# EAGLE design Carte_Puissance_Mark1 (EAGLE 6.1)
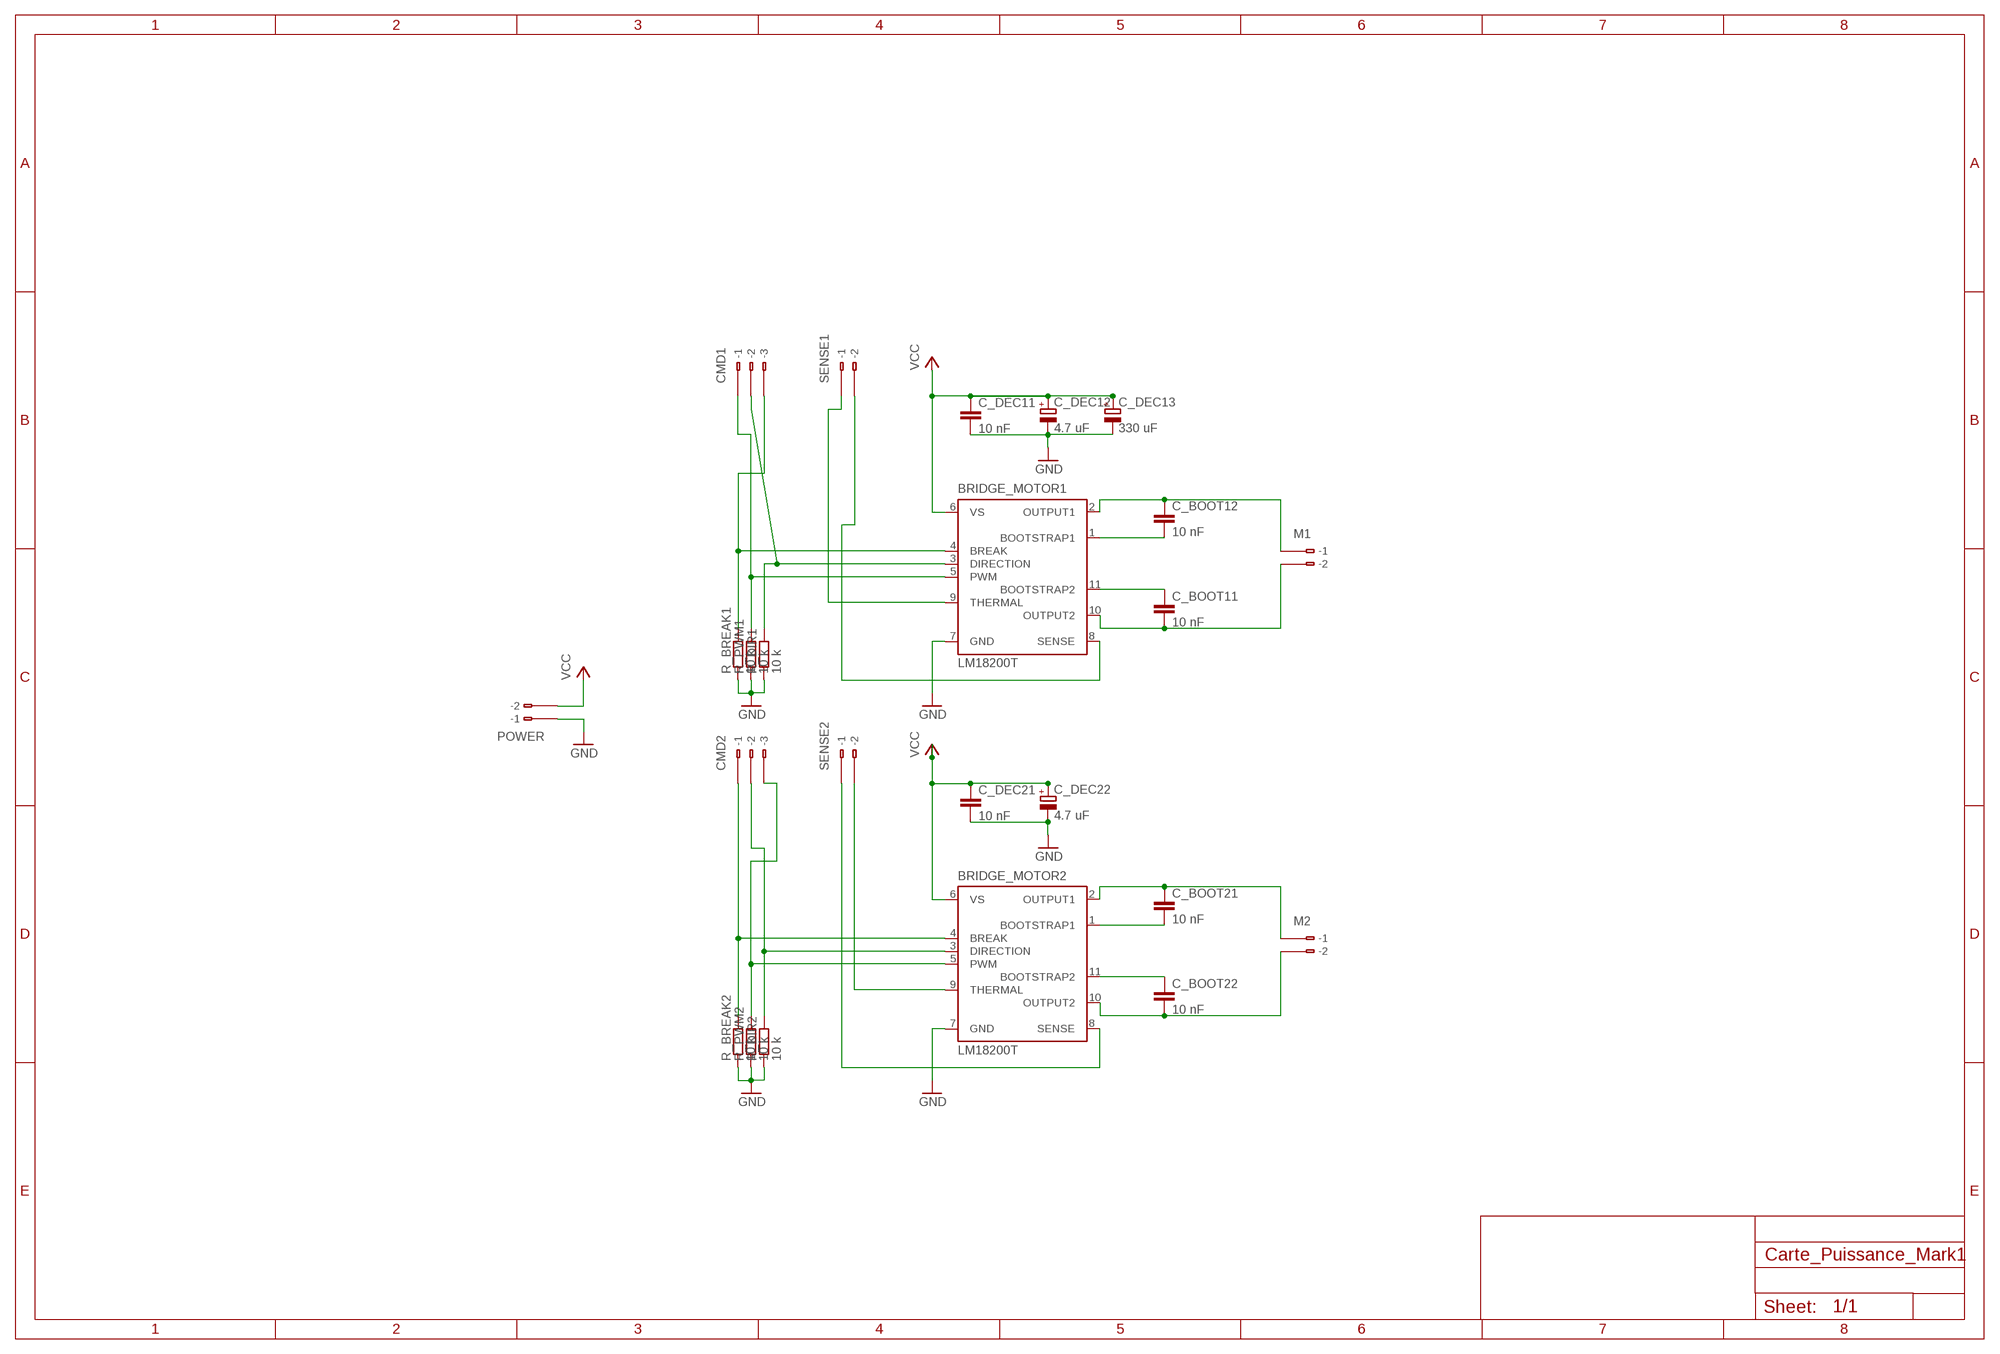
[diagram p0: schematic, sheet 1]

## Parts
BRIDGE_MOTOR1  LM18200T  [TO-220-11]
BRIDGE_MOTOR2  LM18200T  [TO-220-11]
C_BOOT11  10 nF  C5/3  [C5B3]
C_BOOT12  10 nF  C5/3  [C5B3]
C_BOOT21  10 nF  C5/3  [C5B3]
C_BOOT22  10 nF  C5/3  [C5B3]
C_DEC11  10 nF  C5/3  [C5B3]
C_DEC12  4.7 uF  CPOL-EUE2-5  [E2-5]
C_DEC13  330 uF  CPOL-EUE5-10.5  [E5-10,5]
C_DEC21  10 nF  C5/3  [C5B3]
C_DEC22  4.7 uF  CPOL-EUE2-5  [E2-5]
CMD1  233-103  [233-103]
CMD2  233-103  [233-103]
M1  233-102  [233-102]
M2  233-102  [233-102]
POWER  233-102  [233-102]
R_BREAK1  10 k  R-EU_R2012  [R2012]
R_BREAK2  10 k  R-EU_R2012  [R2012]
R_DIR1  10 k  R-EU_R2012  [R2012]
R_DIR2  10 k  R-EU_R2012  [R2012]
R_PWM1  10 k  R-EU_R2012  [R2012]
R_PWM2  10 k  R-EU_R2012  [R2012]
SENSE1  233-102  [233-102]
SENSE2  233-102  [233-102]

## Nets
GND: BRIDGE_MOTOR1.7(GND) BRIDGE_MOTOR2.7(GND) C_DEC11.2 C_DEC12.- C_DEC13.- C_DEC21.2 C_DEC22.- R_BREAK1.1 R_BREAK2.1 R_DIR1.1 R_DIR2.1 R_PWM1.1 R_PWM2.1
N$1: BRIDGE_MOTOR1.4(BREAK) CMD1.B3(B-3) R_BREAK1.2
N$2: BRIDGE_MOTOR1.5(PWM) CMD1.B1(B-1) R_PWM1.2
N$3: BRIDGE_MOTOR2.11(BOOTSTRAP2) C_BOOT22.1
N$4: BRIDGE_MOTOR2.1(BOOTSTRAP1) C_BOOT21.2
N$5: BRIDGE_MOTOR2.2(OUTPUT1) C_BOOT21.1 M2.B1(B-1)
N$6: BRIDGE_MOTOR2.10(OUTPUT2) C_BOOT22.2 M2.B2(B-2)
N$7: BRIDGE_MOTOR1.11(BOOTSTRAP2) C_BOOT11.1
N$8: BRIDGE_MOTOR1.1(BOOTSTRAP1) C_BOOT12.2
N$9: BRIDGE_MOTOR1.2(OUTPUT1) C_BOOT12.1 M1.B1(B-1)
N$10: BRIDGE_MOTOR1.10(OUTPUT2) C_BOOT11.2 M1.B2(B-2)
N$11: BRIDGE_MOTOR1.3(DIRECTION) CMD1.B2(B-2) R_DIR1.2
N$12: BRIDGE_MOTOR1.9(THERMAL) SENSE1.B1(B-1)
N$13: BRIDGE_MOTOR1.8(SENSE) SENSE1.B2(B-2)
N$14: BRIDGE_MOTOR2.4(BREAK) CMD2.B1(B-1) R_BREAK2.2
N$15: BRIDGE_MOTOR2.5(PWM) CMD2.B3(B-3) R_PWM2.2
N$16: BRIDGE_MOTOR2.3(DIRECTION) CMD2.B2(B-2) R_DIR2.2
N$17: BRIDGE_MOTOR2.9(THERMAL) SENSE2.B2(B-2)
N$18: BRIDGE_MOTOR2.8(SENSE) SENSE2.B1(B-1)
POWERT: POWER.B1(B-1) ; supply symbol labelled GND
VCC: BRIDGE_MOTOR1.6(VS) BRIDGE_MOTOR2.6(VS) C_DEC11.1 C_DEC12.+ C_DEC13.+ C_DEC21.1 C_DEC22.+ POWER.B2(B-2)
Unconnected: CMD1.A1(-1) CMD1.A2(-2) CMD1.A3(-3) CMD2.A1(-1) CMD2.A2(-2) CMD2.A3(-3) M1.A1(-1) M1.A2(-2) M2.A1(-1) M2.A2(-2) POWER.A1(-1) POWER.A2(-2) SENSE1.A1(-1) SENSE1.A2(-2) SENSE2.A1(-1) SENSE2.A2(-2)

## Library data of the parts
BRIDGE_MOTOR1 BRIDGE_MOTOR2 = national-semiconductor:LM18200T: 3A, 55V H-Bridge Motor Control SourcE: http://cache.national.com/ds/LM/LMD18200.pdf; OC_FARNELL: unknown; OC_NEWARK: unknown
C_BOOT11 C_BOOT12 C_BOOT21 C_BOOT22 C_DEC11 C_DEC21 = capacitor-wima:C: CAPACITOR naming: grid - package width
C_DEC12 C_DEC13 C_DEC22 = rcl:CPOL-EU: POLARIZED CAPACITOR, European symbol
CMD1 CMD2 = con-wago:233-103: WAGO Cage Clamp; MPN: 233-103; OC_FARNELL: unknown; OC_NEWARK: 28K9045
M1 M2 POWER SENSE1 SENSE2 = con-wago:233-102: WAGO Cage Clamp; MPN: 233-102; OC_FARNELL: unknown; OC_NEWARK: 28K9044
R_BREAK1 R_BREAK2 R_DIR1 R_DIR2 R_PWM1 R_PWM2 = resistor:R-EU_: RESISTOR, European symbol

## Board
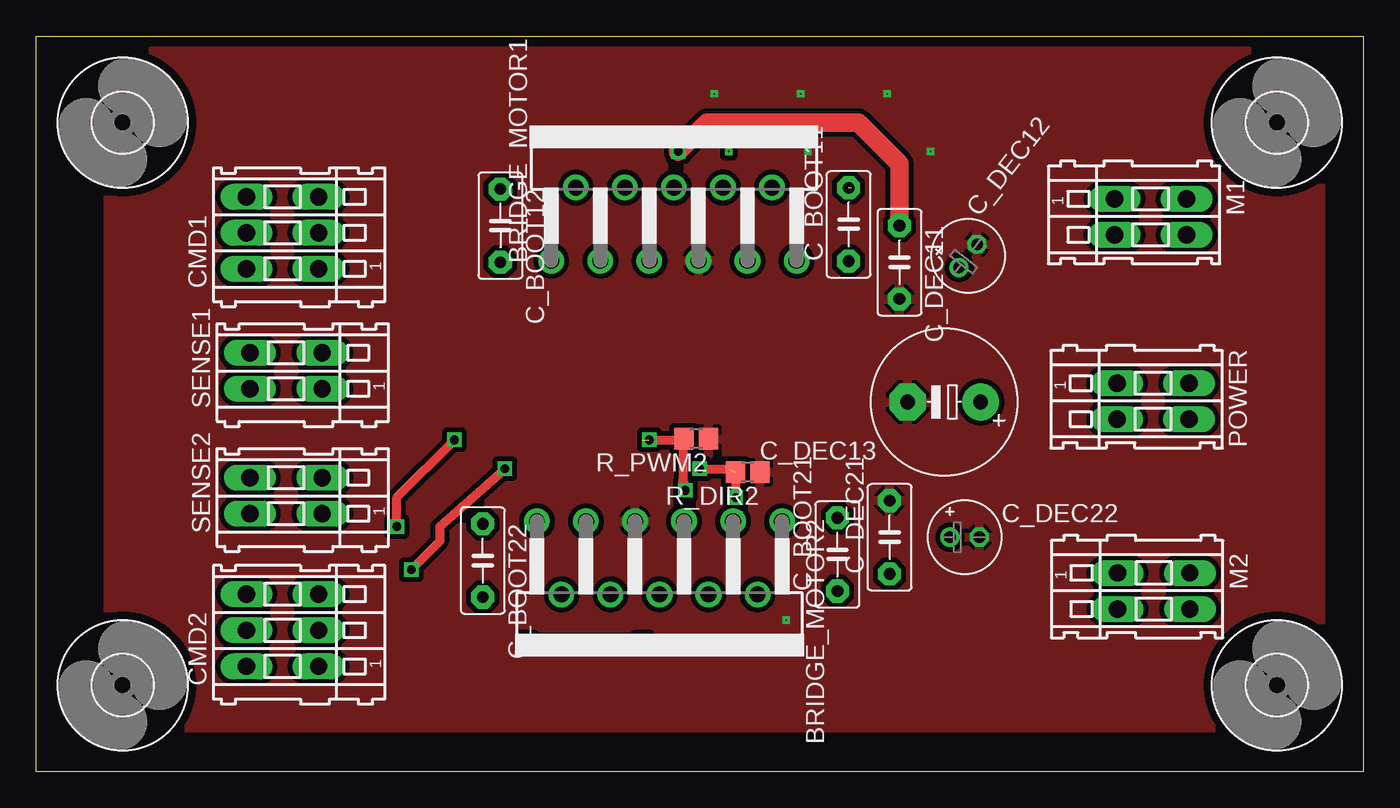
[diagram p1: board, top side]
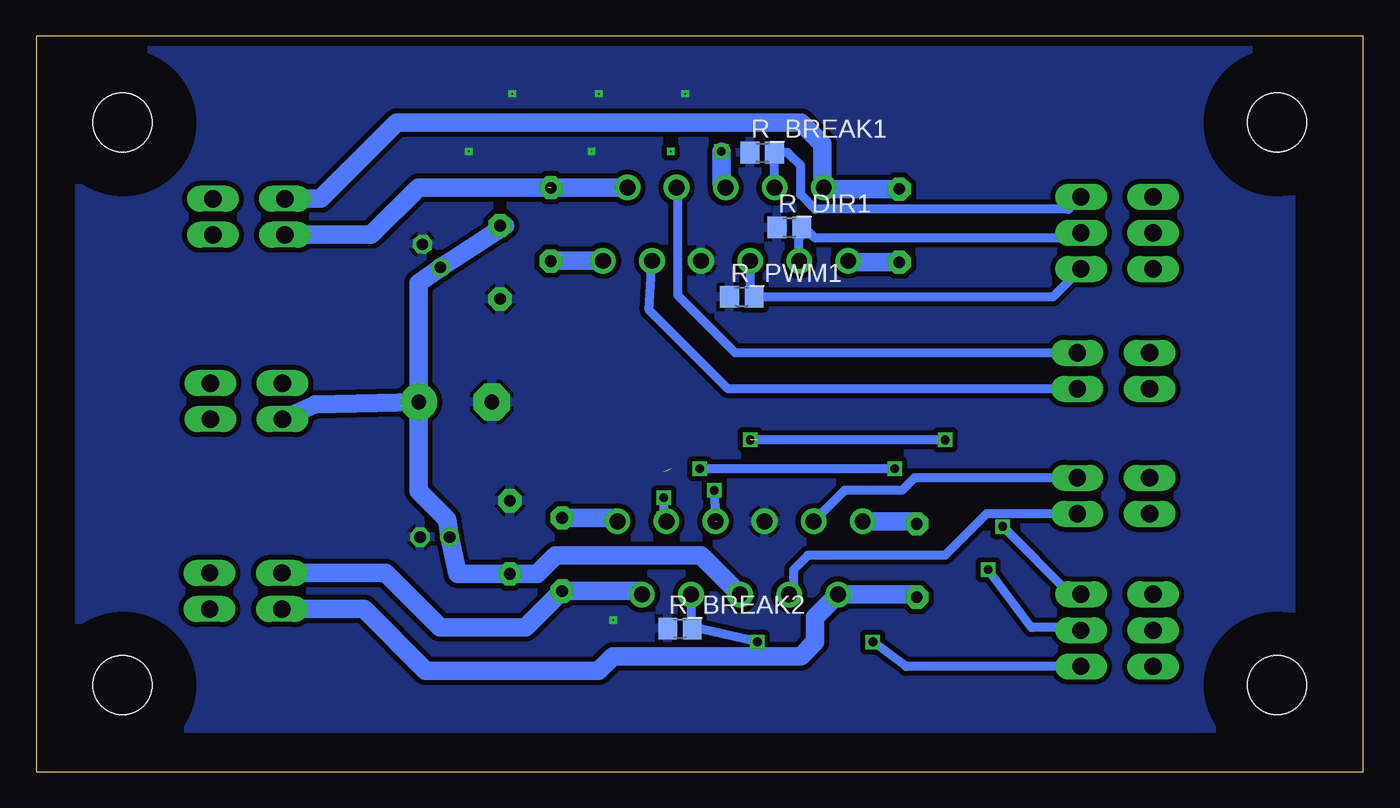
[diagram p2: board, bottom side, seen from below]

Size 92 x 51 mm. Coordinates in mm from the lower left corner, seen from the top.
Outline: 0,0 0,51 92,51 92,0 0,0
Copper layers (1*16): Top 0.035mm / dielectric 1.5mm / Bottom 0.035mm
Design rules: minimum track width 10mil, minimum drill 1mil, track to track 14mil, track to pad 8mil, pad to pad 8mil, via to via 8mil, smd to smd 8mil, copper to edge 0mil, drill to drill 8mil, minimum pad ring 10mil, minimum via ring 8mil, stop-mask expansion 4mil, vias tented up to drill 0mil, thermal gap 10mil

### Footprints (pad centres in the part's own frame; a part is rotated, then mirrored left to right if it is on the bottom)
TO-220-11 = drill 1.1 pad 1.778: 1 -8.5,-9.37; 2 -6.8,-4.29; 3 -5.1,-9.37; 4 -3.4,-4.29; 5 -1.7,-9.37; 6 0,-4.29; 7 1.7,-9.37; 8 3.4,-4.29; 9 5.1,-9.37; 10 6.8,-4.29; 11 8.5,-9.37
C5B3 = drill 0.813 pad 1.6 octagon: 1 -2.54,0; 2 2.54,0
E2-5 = drill 0.813 pad 1.27: + -1.016,0 | drill 0.813 pad 1.27 octagon: - 1.016,0
E5-10,5 = drill 1.016 pad 2.54: + -2.54,0 | drill 1.016 pad 2.54 octagon: - 2.54,0
233-103 = drill 1.2 long: A1 -2.5,2.5; A2 0,2.5; A3 2.5,2.5; B1 -2.5,-2.5; B2 0,-2.5; B3 2.5,-2.5
233-102 = drill 1.2 long: A1 -1.25,2.5; A2 1.25,2.5; B1 -1.25,-2.5; B2 1.25,-2.5
R2012 = smd 1.3 x 1.5: 1 -0.85,0; 2 0.85,0
4,1 = hole 4.1: 0,0

### Placement (x,y rotation side)
BRIDGE_MOTOR1  44.21,44.79 0 top
BRIDGE_MOTOR2  43.21,7.99 180 top
C_BOOT11  56.32,37.94 90 top
C_BOOT12  32.18,37.86 270 top
C_BOOT21  55.54,15.06 90 top
C_BOOT22  30.96,14.64 270 top
C_DEC11  59.84,35.32 270 top
C_DEC12  64.6,35.76 52.1 top
C_DEC13  62.94,25.63 180 top
C_DEC21  59.16,16.25 90 top
C_DEC22  64.36,16.26 0 top
CMD1  17.08,37.36 90 top
CMD2  17.08,9.8 90 top
M1  77.25,38.47 270 top
M2  77.47,12.53 270 top
POWER  77.42,25.69 270 top
R_BREAK1  41.67,42.92 0 bottom
R_BREAK2  47.37,9.92 0 bottom
R_DIR1  39.79,37.73 0 bottom
R_DIR2  49.32,20.77 180 top
R_PWM1  43.08,32.92 0 bottom
R_PWM2  45.76,23.08 180 top
SENSE1  17.33,27.79 90 top
SENSE2  17.33,19.13 90 top
U$1  [4,1]  6,45 0 top
U$2  [4,1]  86,45 0 top
U$3  [4,1]  86,6 0 top
U$4  [4,1]  6,6 0 top

### Tracks (layer width: path | path; a pad name or v marks a point on that pad's centre or on a via)
GND  (via drill 0.1)
  Top 0.61: C_DEC11.2 59.84,32.84 60,33
  other vias: 59,47 47,47 53,47 62,43 53.5,43 52,10.5
  pour Top: 5,50 89,50 89,3 5,3
  pour Bottom: 5,50 89,50 89,3 5,3
N$1
  Bottom 0.61: BRIDGE_MOTOR1.4 R_BREAK1.2 39.92,42.92 39,42 39,40 38,39 20.44,39 CMD1.B3
N$2
  Bottom 0.61: BRIDGE_MOTOR1.5 42.51,33.2 R_PWM1.2 21.52,32.92 CMD1.B1
N$3
  Bottom 1.27: BRIDGE_MOTOR2.11 31.14,17.36 C_BOOT22.1
N$4
  Bottom 1.27: C_BOOT21.2 51.95,17.6 BRIDGE_MOTOR2.1
N$5
  Bottom 1.27: BRIDGE_MOTOR2.2 50.25,12.52 C_BOOT21.1 58.06,10 64,10 67.78,13.78 M2.B1
N$6
  Bottom 1.27: C_BOOT22.2 31.14,12.28 BRIDGE_MOTOR2.10 38,10.69 38,9 39,8 52,8 53,7 65,7 69.28,11.28 M2.B2
N$7
  Bottom 1.27: BRIDGE_MOTOR1.11 56.3,35.42 C_BOOT11.1
N$8
  Bottom 1.27: C_BOOT12.2 35.61,35.32 BRIDGE_MOTOR1.1
N$9
  Bottom 1.27: C_BOOT12.1 37.31,40.4 BRIDGE_MOTOR1.2 37.5,40.59 37.5,43.5 39,45 67,45 72.28,39.72 M1.B1
N$10  (1 unrouted)
  Bottom 1.27: C_BOOT11.2 51.03,40.48 BRIDGE_MOTOR1.10 | M1.B2 68.78,37.22 65.5,40.5 56.5,40.5
N$11
  Bottom 0.61: BRIDGE_MOTOR1.3 39.11,37 | 39.11,37 39.11,37.89 39,38 38,37 19.94,37 CMD1.B2 | R_DIR1.2 38.94,37.17 39.11,37
N$12
  Bottom 0.61: SENSE1.B1 43.54,26.54 44.04,26.54 49.5,32 BRIDGE_MOTOR1.9
N$13
  Bottom 0.61: SENSE1.B2 43.54,29.04 47.5,33 47.5,40.39 BRIDGE_MOTOR1.8
N$14  (via drill 0.6)
  Top 0.61: v34,9 v42,9
  Bottom 0.61: BRIDGE_MOTOR2.4 46.61,10.01 R_BREAK2.2 46.44,10 v42,9 | CMD2.B1 31.7,7.3 v34,9
N$15  (via drill 0.6)  (2 unrouted)
  Top 0.61: v25,17 25,19 v29,23 | v42.5,23 44.83,23 | 44.83,23 R_PWM2.2 | 44.83,23 44.83,20.17 v45,19.5
  Bottom 0.61: CMD2.B3 20.3,12.3 v25,17 | v29,23 42,23 | 44.82,17.32 v45,19.5
N$16  (via drill 0.6)  (1 unrouted)
  Top 0.61: v26,14 28,16 28,17 v32.5,21 | R_DIR2.2 48.47,19.03 v48.5,19 | v48.5,17.55 BRIDGE_MOTOR2.3 | v46,21 48,21
  Bottom 0.61: CMD2.B2 20.78,10 23,10 v26,14 | v32.5,21 v46,21 | v48.5,19 v48.5,17.55
N$17
  Bottom 0.61: SENSE2.B2 31.12,20.38 32,19.5 35.97,19.5 BRIDGE_MOTOR2.9
N$18
  Bottom 0.61: SENSE2.B1 26.12,17.88 29,15 38.5,15 39.5,14 39.5,12.59 BRIDGE_MOTOR2.8
N$65  (via drill 0.1)
  other vias: 48,43
VCC  (via drill 0.6)
  Top 1.27: C_DEC11.1 59.84,42.16 57,45 47,45 46.5,45 v44.5,43
  Bottom 1.27: C_DEC11.1 59.48,37.86 C_DEC12.+ 65.48,33.86 C_DEC13.+ | BRIDGE_MOTOR2.6 45.93,15 56,15 57.29,13.71 C_DEC21.1 62.79,13.71 C_DEC22.+ 63.5,17.5 65.48,19.48 C_DEC13.+ | POWER.B2 72.67,25.44 C_DEC13.+ | v44.5,43 44.5,40.79 BRIDGE_MOTOR1.6